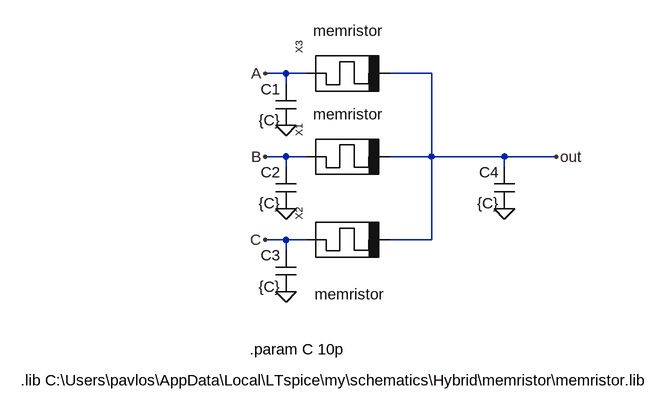
[diagram p0: schematic or3.asc]
or3.asc, the LTspice schematic file:
Version 4
SHEET 1 880 680
WIRE -384 -560 -416 -560
WIRE -352 -560 -384 -560
WIRE -160 -560 -224 -560
WIRE -384 -544 -384 -560
WIRE -384 -432 -416 -432
WIRE -352 -432 -384 -432
WIRE -160 -432 -160 -560
WIRE -160 -432 -224 -432
WIRE -48 -432 -160 -432
WIRE 32 -432 -48 -432
WIRE -384 -416 -384 -432
WIRE -48 -416 -48 -432
WIRE -384 -304 -416 -304
WIRE -352 -304 -384 -304
WIRE -160 -304 -160 -432
WIRE -160 -304 -224 -304
WIRE -384 -288 -384 -304
FLAG 32 -432 out
FLAG -416 -432 B
FLAG -416 -304 C
FLAG -48 -352 0
FLAG -384 -352 0
FLAG -384 -224 0
FLAG -416 -560 A
FLAG -384 -480 0
SYMBOL cap -32 -416 M0
SYMATTR InstName C4
SYMATTR Value {C}
SYMBOL memristor -288 -432 R270
WINDOW 3 81 0 VBottom 2
WINDOW 39 61 -9 VBottom 2
SYMATTR InstName X1
SYMBOL memristor -288 -304 R270
WINDOW 3 -68 2 VBottom 2
WINDOW 39 -94 3 VBottom 2
SYMATTR InstName X2
SYMBOL cap -368 -416 M0
SYMATTR InstName C2
SYMATTR Value {C}
SYMBOL cap -368 -288 M0
SYMATTR InstName C3
SYMATTR Value {C}
SYMBOL memristor -288 -560 R270
WINDOW 3 81 0 VBottom 2
WINDOW 39 61 -9 VBottom 2
SYMATTR InstName X3
SYMBOL cap -368 -544 M0
SYMATTR InstName C1
SYMATTR Value {C}
TEXT -440 -136 Left 2 !.param C 10p
TEXT -792 -88 Left 2 !.lib C:\\Users\\pavlos\\AppData\\Local\\LTspice\\my\\schematics\\Hybrid\\memristor\\memristor.lib

The netlist it stands for:
* or3.asc
C4 out 0 {C}
XX1 B out memristor  ; pins plus minus
XX2 C out memristor  ; pins plus minus
C2 B 0 {C}
C3 C 0 {C}
XX3 A out memristor  ; pins plus minus
C1 A 0 {C}
.param C 10p
.lib C:\Users\pavlos\AppData\Local\LTspice\my\schematics\Hybrid\memristor\memristor.lib
.backanno
.end